# Altium schematic sheet MCISO-S01-V00-Master.SchDoc
size A3; SheetNumber: 1; SheetTotal: 8
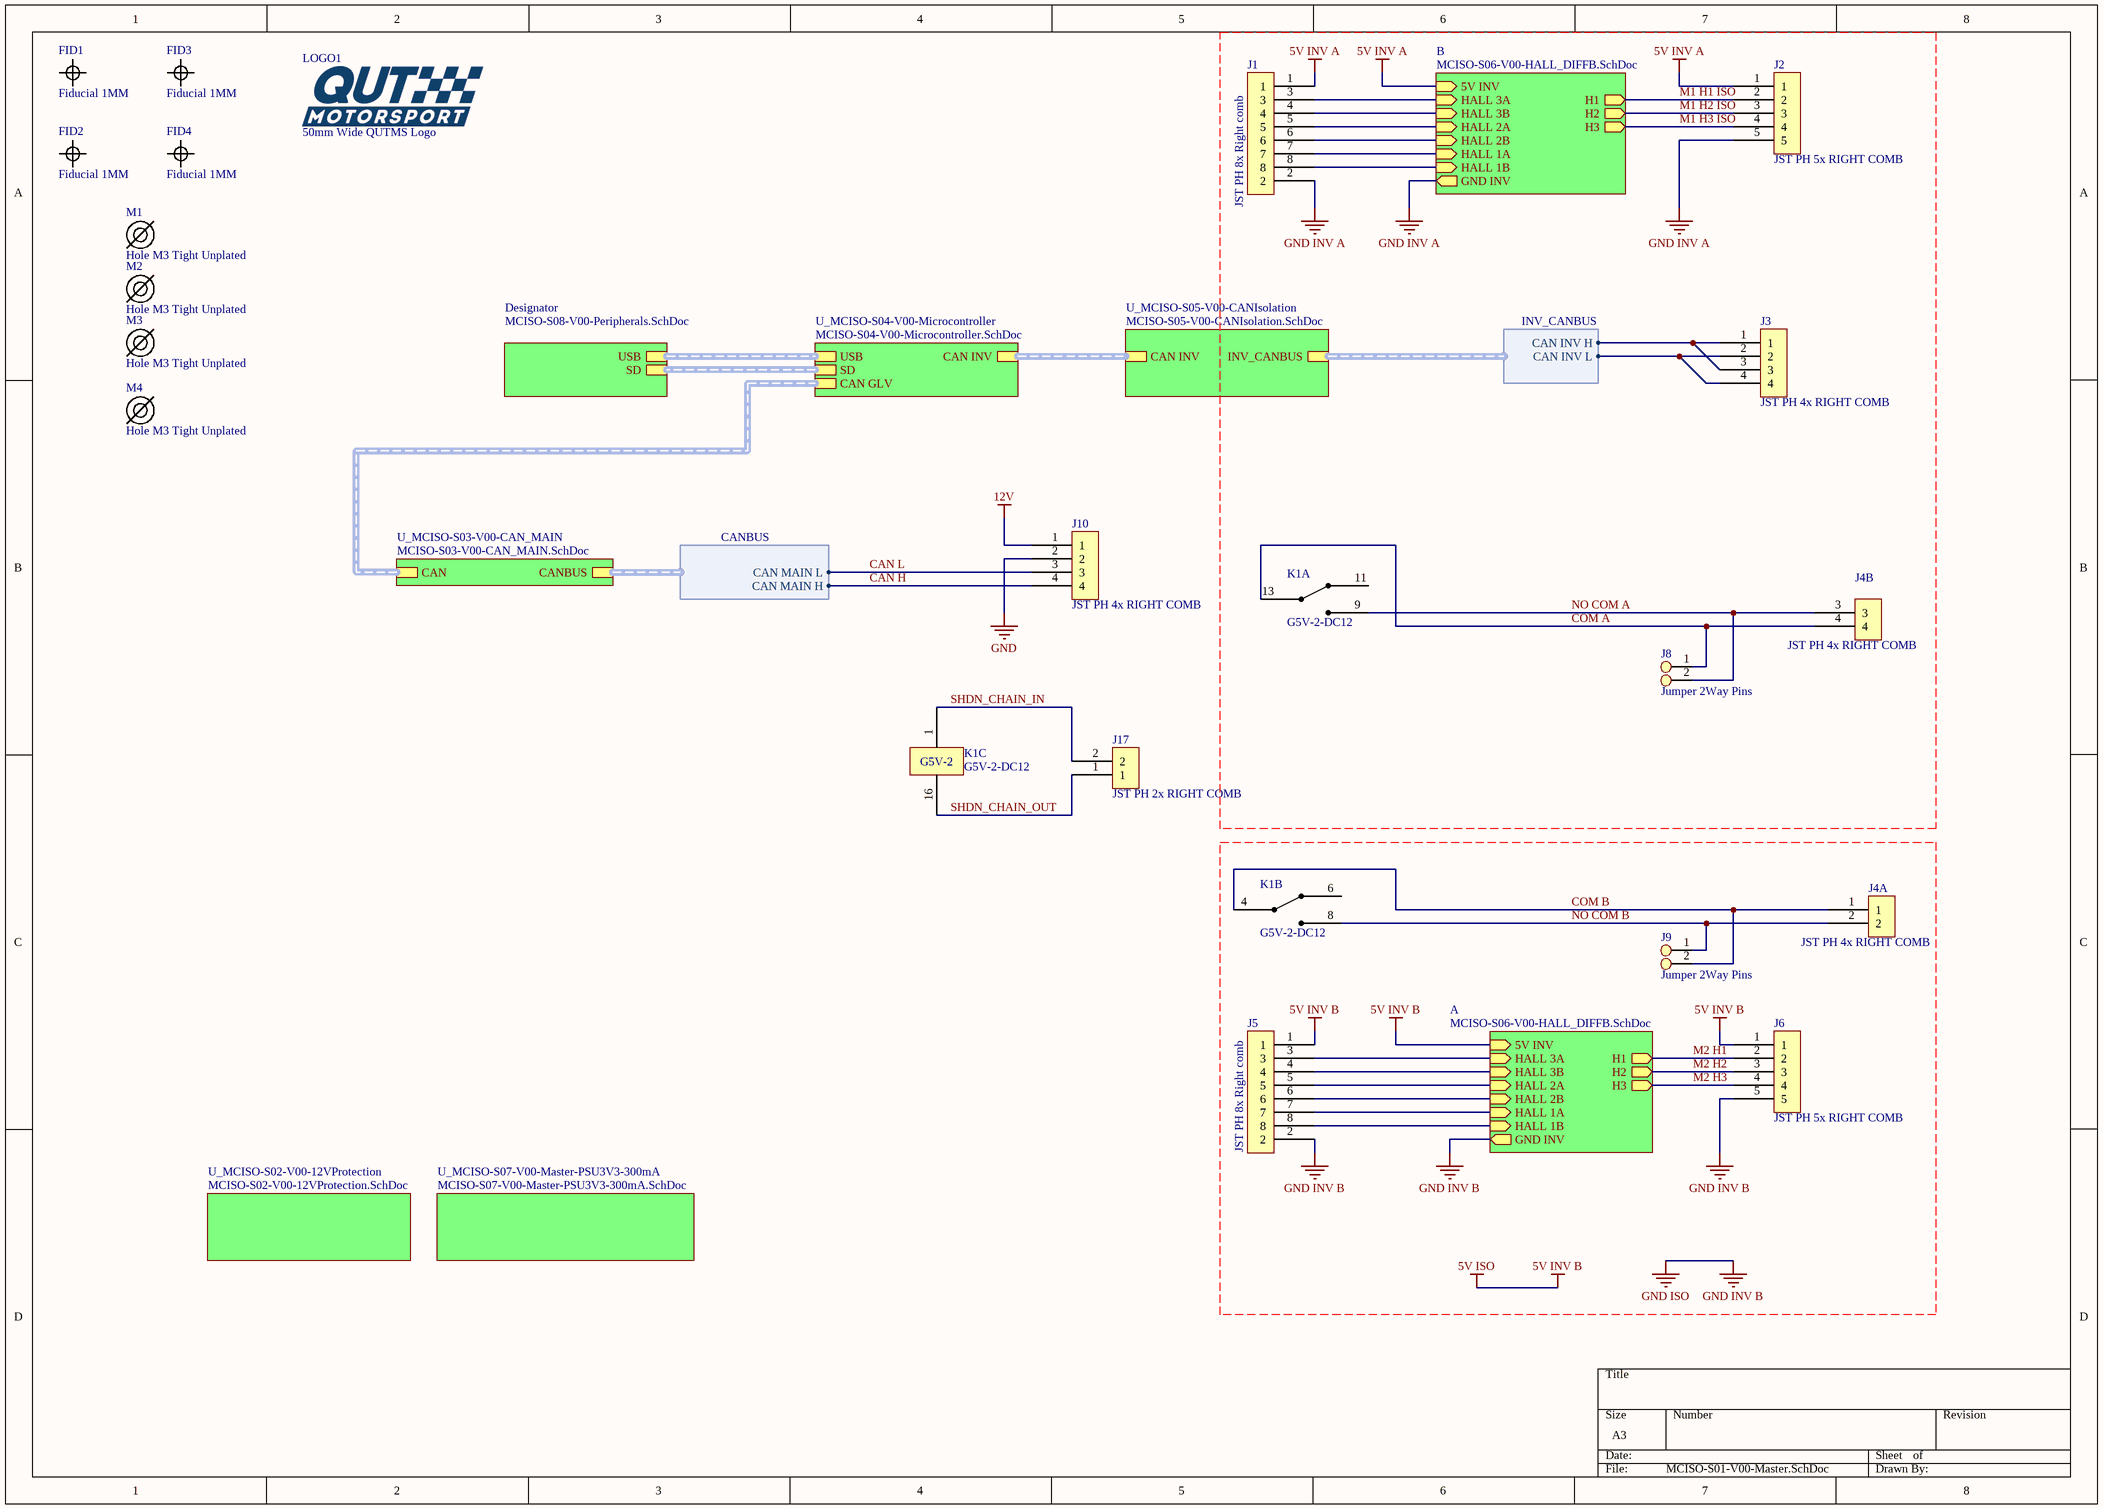
[diagram p0: MCISO-S01-V00-Master.SchDoc]

## Parts
FID1  Fiducial 1MM  [FIDUCIAL 1MM]  (no BOM)
FID2  Fiducial 1MM  [FIDUCIAL 1MM]  (no BOM)
FID3  Fiducial 1MM  [FIDUCIAL 1MM]  (no BOM)
FID4  Fiducial 1MM  [FIDUCIAL 1MM]  (no BOM)
J1  JST PH 8x Right comb  [JST PH 8x RIGHT SMD]
J2  JST PH 5x RIGHT COMB  [JST PH 5x RIGHT COMB]
J3  JST PH 4x RIGHT COMB  [JST PH 4x RIGHT COMB]
J4  JST PH 4x RIGHT COMB  [JST PH 4x RIGHT COMB]  (parts A,B of 2)
J5  JST PH 8x Right comb  [JST PH 8x RIGHT SMD]
J6  JST PH 5x RIGHT COMB  [JST PH 5x RIGHT COMB]
J8  Jumper 2Way Pins  [Jumper_2Way_Pin]
J9  Jumper 2Way Pins  [Jumper_2Way_Pin]
J10  JST PH 4x RIGHT COMB  [JST PH 4x RIGHT COMB]
J17  JST PH 2x RIGHT COMB  [JST PH 2x RIGHT COMB]
K1  G5V-2-DC12  [G5V-2]  (parts A,B,C of 3)
LOGO1  50mm Wide QUTMS Logo  [QUTMS LOGO 10MM]  (no BOM)
M1  Hole M3 Tight Unplated  [M3.2 UNPLATED]
M2  Hole M3 Tight Unplated  [M3.2 UNPLATED]
M3  Hole M3 Tight Unplated  [M3.2 UNPLATED]
M4  Hole M3 Tight Unplated  [M3.2 UNPLATED]

## Sub-sheets
A = MCISO-S06-V00-HALL_DIFFB.SchDoc: H1 (out), H2 (out), H3 (out), HALL 1A (in), HALL 1B (in), HALL 2A (in), HALL 2B (in), HALL 3A (in), HALL 3B (in), 5V INV (in), GND INV (out)
B = MCISO-S06-V00-HALL_DIFFB.SchDoc: H1 (out), H2 (out), H3 (out), HALL 1A (in), HALL 1B (in), HALL 2A (in), HALL 2B (in), HALL 3A (in), HALL 3B (in), 5V INV (in), GND INV (out)
Designator = MCISO-S08-V00-Peripherals.SchDoc: USB (harness USB), SD (harness SD)
U_MCISO-S02-V00-12VProtection = MCISO-S02-V00-12VProtection.SchDoc: no entries
U_MCISO-S03-V00-CAN_MAIN = MCISO-S03-V00-CAN_MAIN.SchDoc: CANBUS (harness CANBUS), CAN (harness CAN)
U_MCISO-S04-V00-Microcontroller = MCISO-S04-V00-Microcontroller.SchDoc: CAN GLV (harness CAN MAIN), CAN INV (harness CAN INV), USB (harness USB-C), SD (harness SD)
U_MCISO-S05-V00-CANIsolation = MCISO-S05-V00-CANIsolation.SchDoc: INV_CANBUS (harness INV_CANBUS), CAN INV (harness CAN)
U_MCISO-S07-V00-Master-PSU3V3-300mA = MCISO-S07-V00-Master-PSU3V3-300mA.SchDoc: no entries

## Harnesses
INV_CANBUS: CAN INV H, CAN INV L
CANBUS: CAN MAIN H, CAN MAIN L

## Nets
5V INV A: J1.1 J2.1 ; sheet B/5V INV
5V INV B: J5.1 J6.1 ; sheet A/5V INV  [also labelled 5V ISO]
12V: J10.1
GND: J10.2
GND INV A: J1.2 J2.5 ; sheet B/GND INV
GND INV B: J5.2 J6.5 ; sheet A/GND INV  [also labelled GND ISO]
CAN H: J10.4 ; sheet U_MCISO-S03-V00-CAN_MAIN/CANBUS.CAN MAIN H
CAN L: J10.3 ; sheet U_MCISO-S03-V00-CAN_MAIN/CANBUS.CAN MAIN L
COM A: J4.4 J8.1 K1.13
COM B: J4.1 J9.2 K1.4
M1 H1 ISO: J2.2 ; sheet B/H1
M1 H2 ISO: J2.3 ; sheet B/H2
M1 H3 ISO: J2.4 ; sheet B/H3
M2 H1: J6.2 ; sheet A/H1
M2 H2: J6.3 ; sheet A/H2
M2 H3: J6.4 ; sheet A/H3
NO COM A: J4.3 J8.2 K1.9
NO COM B: J4.2 J9.1 K1.8
SHDN_CHAIN_IN: J17.2 K1.1
SHDN_CHAIN_OUT: J17.1 K1.16
NetJ1_3: J1.3 ; sheet B/HALL 3A
NetJ1_4: J1.4 ; sheet B/HALL 3B
NetJ1_5: J1.5 ; sheet B/HALL 2A
NetJ1_6: J1.6 ; sheet B/HALL 2B
NetJ1_7: J1.7 ; sheet B/HALL 1A
NetJ1_8: J1.8 ; sheet B/HALL 1B
NetJ3_1: J3.1 J3.3 ; sheet U_MCISO-S05-V00-CANIsolation/INV_CANBUS.CAN INV H
NetJ3_2: J3.2 J3.4 ; sheet U_MCISO-S05-V00-CANIsolation/INV_CANBUS.CAN INV L
NetJ5_3: J5.3 ; sheet A/HALL 3A
NetJ5_4: J5.4 ; sheet A/HALL 3B
NetJ5_5: J5.5 ; sheet A/HALL 2A
NetJ5_6: J5.6 ; sheet A/HALL 2B
NetJ5_7: J5.7 ; sheet A/HALL 1A
NetJ5_8: J5.8 ; sheet A/HALL 1B

Not connected (* = marked no-connect by the designer): K1 6 11

## Buses and harness runs
harness sheet Designator/SD = sheet U_MCISO-S04-V00-Microcontroller/SD
harness sheet Designator/USB = sheet U_MCISO-S04-V00-Microcontroller/USB
harness sheet U_MCISO-S03-V00-CAN_MAIN/CAN = sheet U_MCISO-S04-V00-Microcontroller/CAN GLV
harness sheet U_MCISO-S04-V00-Microcontroller/CAN INV = sheet U_MCISO-S05-V00-CANIsolation/CAN INV

## Notes on the sheet
- (in symbol G5V-2-DC12, part C) G5V-2

## Library data of the parts
J4 = JST PH 4x RIGHT COMB_1
J8 J9 = Jumper 2Way Side Pins
K1 = G5V-2-DC12: General Purpose Relay DPDT (2 Form C) Through Hole, 12V, 2A
LOGO1 = QUTMS Logo 50mm
M1-M4 = Hole M3 Tight Unplated: M3.2 Hole, No Plating